# EAGLE design chart2 (EAGLE 7.6.0)
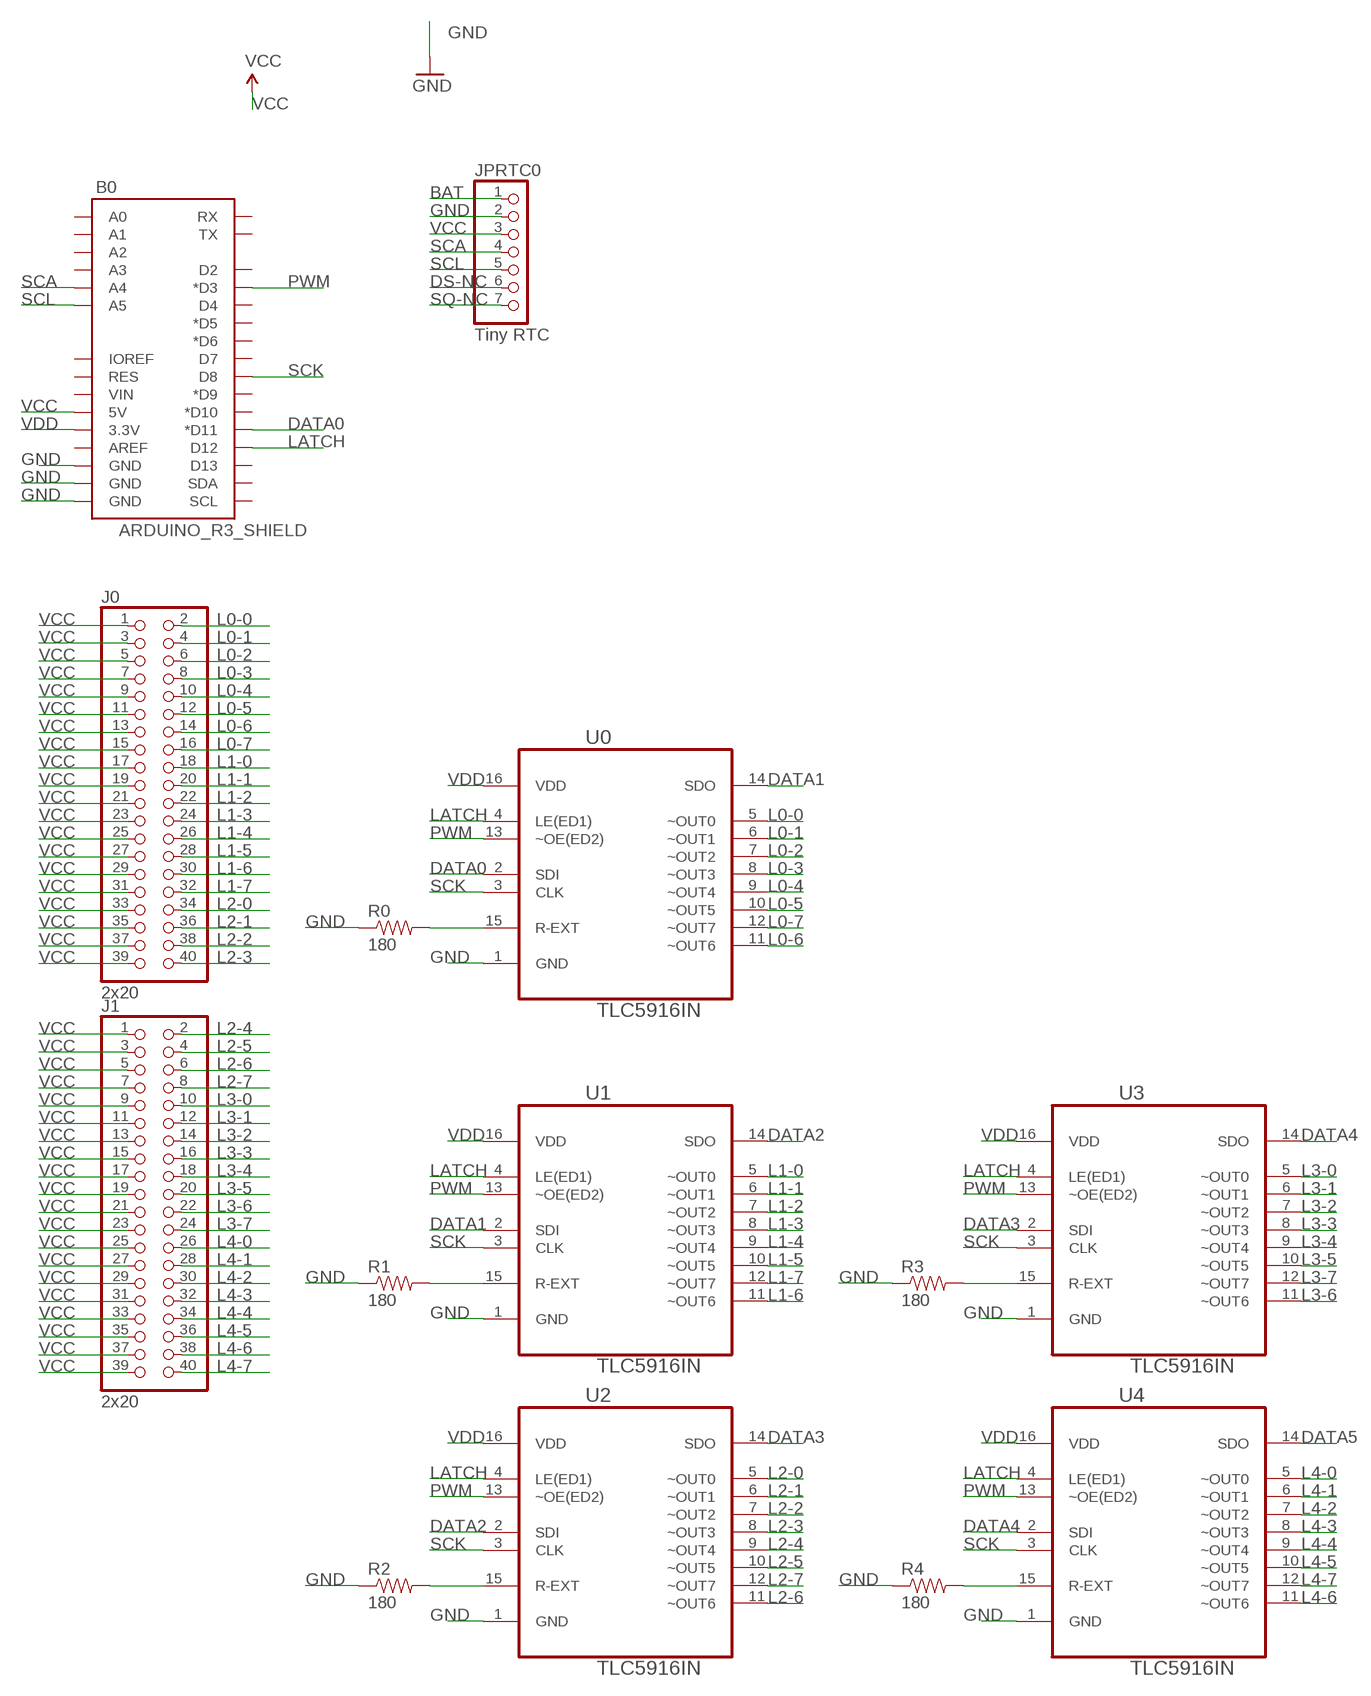
[diagram p0: schematic, sheet 1]

## Parts
B0  ARDUINO_R3_SHIELD  [UNO_R3_SHIELD]
J0  2x20  PINHD-2X20/90  [2X20/90]
J1  2x20  PINHD-2X20/90  [2X20/90]
JPRTC0  Tiny RTC  PINHD-1X7  [1X07]
R0  180  RESISTORPTH-1/4W  [AXIAL-0.4]
R1  180  RESISTORPTH-1/4W  [AXIAL-0.4]
R2  180  RESISTORPTH-1/4W  [AXIAL-0.4]
R3  180  RESISTORPTH-1/4W  [AXIAL-0.4]
R4  180  RESISTORPTH-1/4W  [AXIAL-0.4]
U0  TLC5916IN  [DIP254P762X508-16]
U1  TLC5916IN  [DIP254P762X508-16]
U2  TLC5916IN  [DIP254P762X508-16]
U3  TLC5916IN  [DIP254P762X508-16]
U4  TLC5916IN  [DIP254P762X508-16]

## Nets
BAT: JPRTC0.1
DATA0: B0.D11(*D11) U0.2(SDI)
DATA1: U0.14(SDO) U1.2(SDI)
DATA2: U1.14(SDO) U2.2(SDI)
DATA3: U2.14(SDO) U3.2(SDI)
DATA4: U3.14(SDO) U4.2(SDI)
DATA5: U4.14(SDO)
DS-NC: JPRTC0.6
GND [ground]: B0.GND@0(GND) B0.GND@1(GND) B0.GND@2(GND) JPRTC0.2 R0.P$1 R1.P$1 R2.P$1 R3.P$1 R4.P$1 U0.1(GND) U1.1(GND) U2.1(GND) U3.1(GND) U4.1(GND)
L0-0: J0.2 U0.5(~OUT0)
L0-1: J0.4 U0.6(~OUT1)
L0-2: J0.6 U0.7(~OUT2)
L0-3: J0.8 U0.8(~OUT3)
L0-4: J0.10 U0.9(~OUT4)
L0-5: J0.12 U0.10(~OUT5)
L0-6: J0.14 U0.11(~OUT6)
L0-7: J0.16 U0.12(~OUT7)
L1-0: J0.18 U1.5(~OUT0)
L1-1: J0.20 U1.6(~OUT1)
L1-2: J0.22 U1.7(~OUT2)
L1-3: J0.24 U1.8(~OUT3)
L1-4: J0.26 U1.9(~OUT4)
L1-5: J0.28 U1.10(~OUT5)
L1-6: J0.30 U1.11(~OUT6)
L1-7: J0.32 U1.12(~OUT7)
L2-0: J0.34 U2.5(~OUT0)
L2-1: J0.36 U2.6(~OUT1)
L2-2: J0.38 U2.7(~OUT2)
L2-3: J0.40 U2.8(~OUT3)
L2-4: J1.2 U2.9(~OUT4)
L2-5: J1.4 U2.10(~OUT5)
L2-6: J1.6 U2.11(~OUT6)
L2-7: J1.8 U2.12(~OUT7)
L3-0: J1.10 U3.5(~OUT0)
L3-1: J1.12 U3.6(~OUT1)
L3-2: J1.14 U3.7(~OUT2)
L3-3: J1.16 U3.8(~OUT3)
L3-4: J1.18 U3.9(~OUT4)
L3-5: J1.20 U3.10(~OUT5)
L3-6: J1.22 U3.11(~OUT6)
L3-7: J1.24 U3.12(~OUT7)
L4-0: J1.26 U4.5(~OUT0)
L4-1: J1.28 U4.6(~OUT1)
L4-2: J1.30 U4.7(~OUT2)
L4-3: J1.32 U4.8(~OUT3)
L4-4: J1.34 U4.9(~OUT4)
L4-5: J1.36 U4.10(~OUT5)
L4-6: J1.38 U4.11(~OUT6)
L4-7: J1.40 U4.12(~OUT7)
LATCH: B0.D12 U0.4(LE(ED1)) U1.4(LE(ED1)) U2.4(LE(ED1)) U3.4(LE(ED1)) U4.4(LE(ED1))
N$1: R1.P$2 U1.15(R-EXT)
N$2: R2.P$2 U2.15(R-EXT)
N$3: R3.P$2 U3.15(R-EXT)
N$4: R4.P$2 U4.15(R-EXT)
N$6: R0.P$2 U0.15(R-EXT)
PWM: B0.D3(*D3) U0.13(~OE(ED2)) U1.13(~OE(ED2)) U2.13(~OE(ED2)) U3.13(~OE(ED2)) U4.13(~OE(ED2))
SCA: B0.A4 JPRTC0.4
SCK: B0.D8 U0.3(CLK) U1.3(CLK) U2.3(CLK) U3.3(CLK) U4.3(CLK)
SCL: B0.A5 JPRTC0.5
SQ-NC: JPRTC0.7
VCC [VCC]: B0.5V J0.1 J0.3 J0.5 J0.7 J0.9 J0.11 J0.13 J0.15 J0.17 J0.19 J0.21 J0.23 J0.25 J0.27 J0.29 J0.31 J0.33 J0.35 J0.37 J0.39 J1.1 J1.3 J1.5 J1.7 J1.9 J1.11 J1.13 J1.15 J1.17 J1.19 J1.21 J1.23 J1.25 J1.27 J1.29 J1.31 J1.33 J1.35 J1.37 J1.39 JPRTC0.3
VDD [VCC]: B0.3.3V U0.16(VDD) U1.16(VDD) U2.16(VDD) U3.16(VDD) U4.16(VDD)
Unconnected: B0.A0 B0.A1 B0.A2 B0.A3 B0.AREF B0.D2 B0.D4 B0.D5(*D5) B0.D6(*D6) B0.D7 B0.D9(*D9) B0.D10(*D10) B0.D13 B0.IOREF B0.RES B0.RX B0.SCL B0.SDA B0.TX B0.VIN

## Library data of the parts
B0 = SparkFun-Boards:ARDUINO_R3_SHIELD: Shield form compatible with the Arduino Uno R3.
J0 J1 = pinhead:PINHD-2X20: PIN HEADER
JPRTC0 = pinhead:PINHD-1X7: PIN HEADER
R0 R1-R4 = SparkFun-Resistors:RESISTOR: Resistor Basic schematic elements and footprints for 0603, 1206, and PTH resistors.
U0 U1-U4 = Texas Instruments_By_element14_Batch_1:TLC5916IN: 8-CHANNEL CONSTANT-CURRENT LED SINK DRIVERS; MPN: TLC5916IN; OC_FARNELL: 1647814; OC_NEWARK: 60M1749; PACKAGE: PDIP-16; SUPPLIER: Texas Instruments

## Net classes
0 default: width 0.254 mm, clearance 0.205 mm
1 ground: width 0.635 mm, clearance 0.205 mm to class 0, clearance 0.254 mm
2 VCC: width 0.635 mm, clearance 0.205 mm to class 0, clearance 0.205 mm to class 1, clearance 0.254 mm

## Board
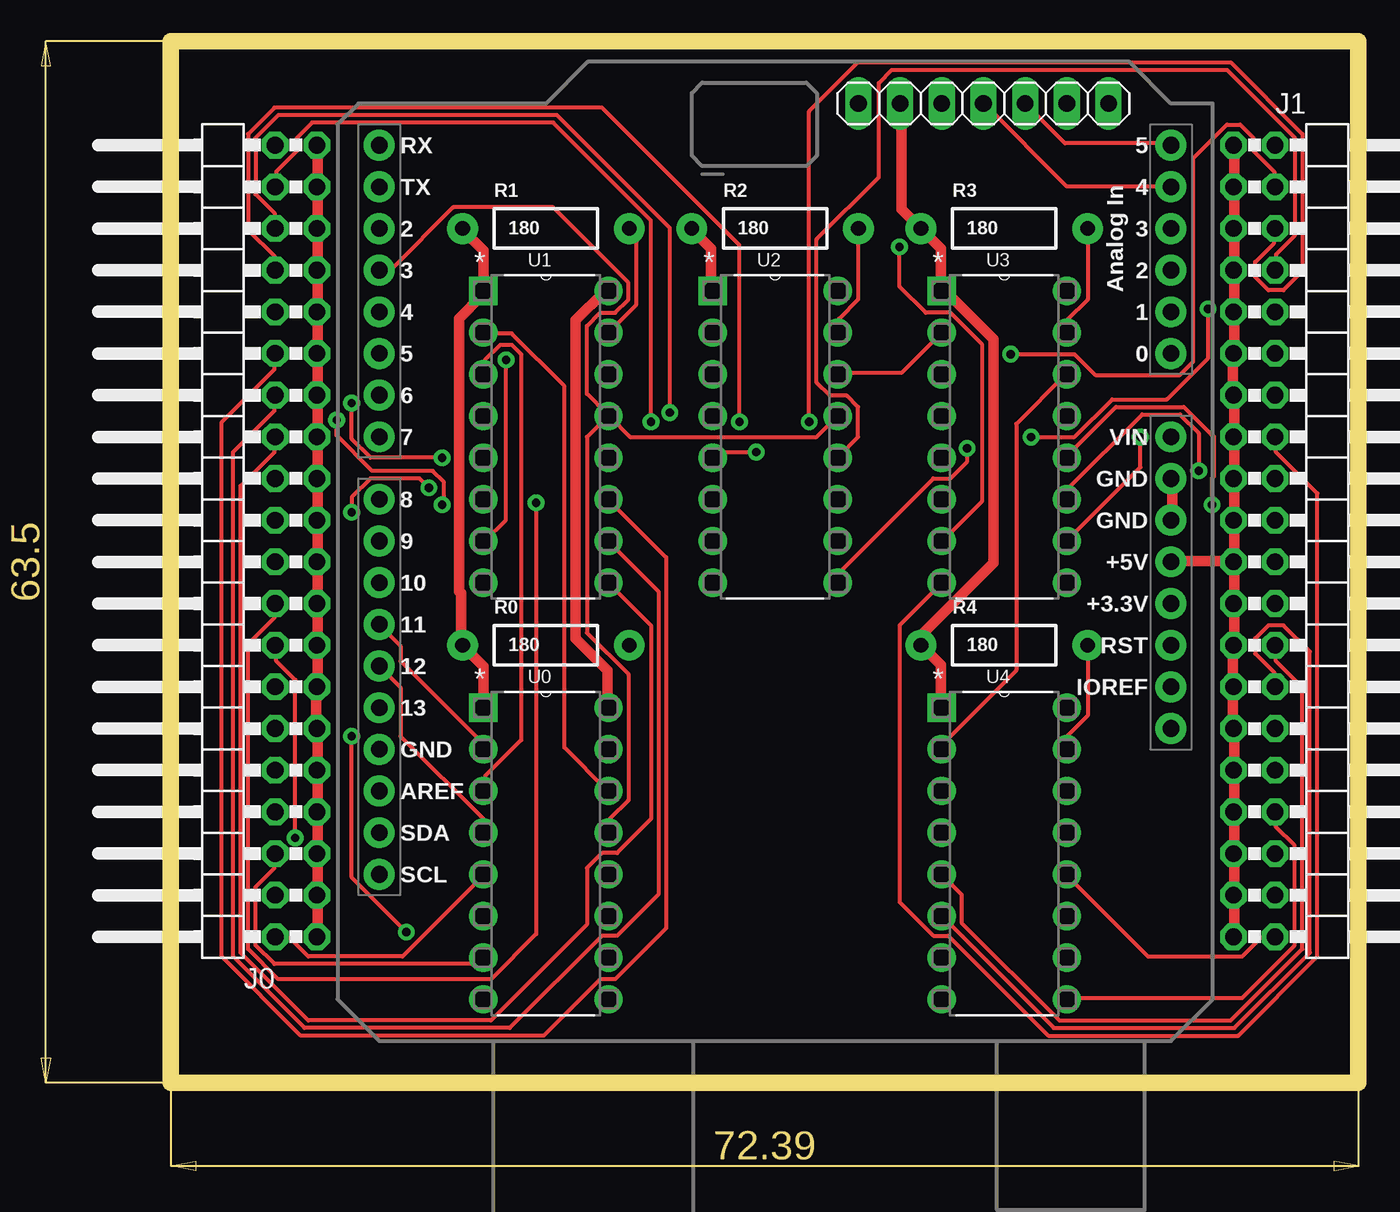
[diagram p1: board, top side]
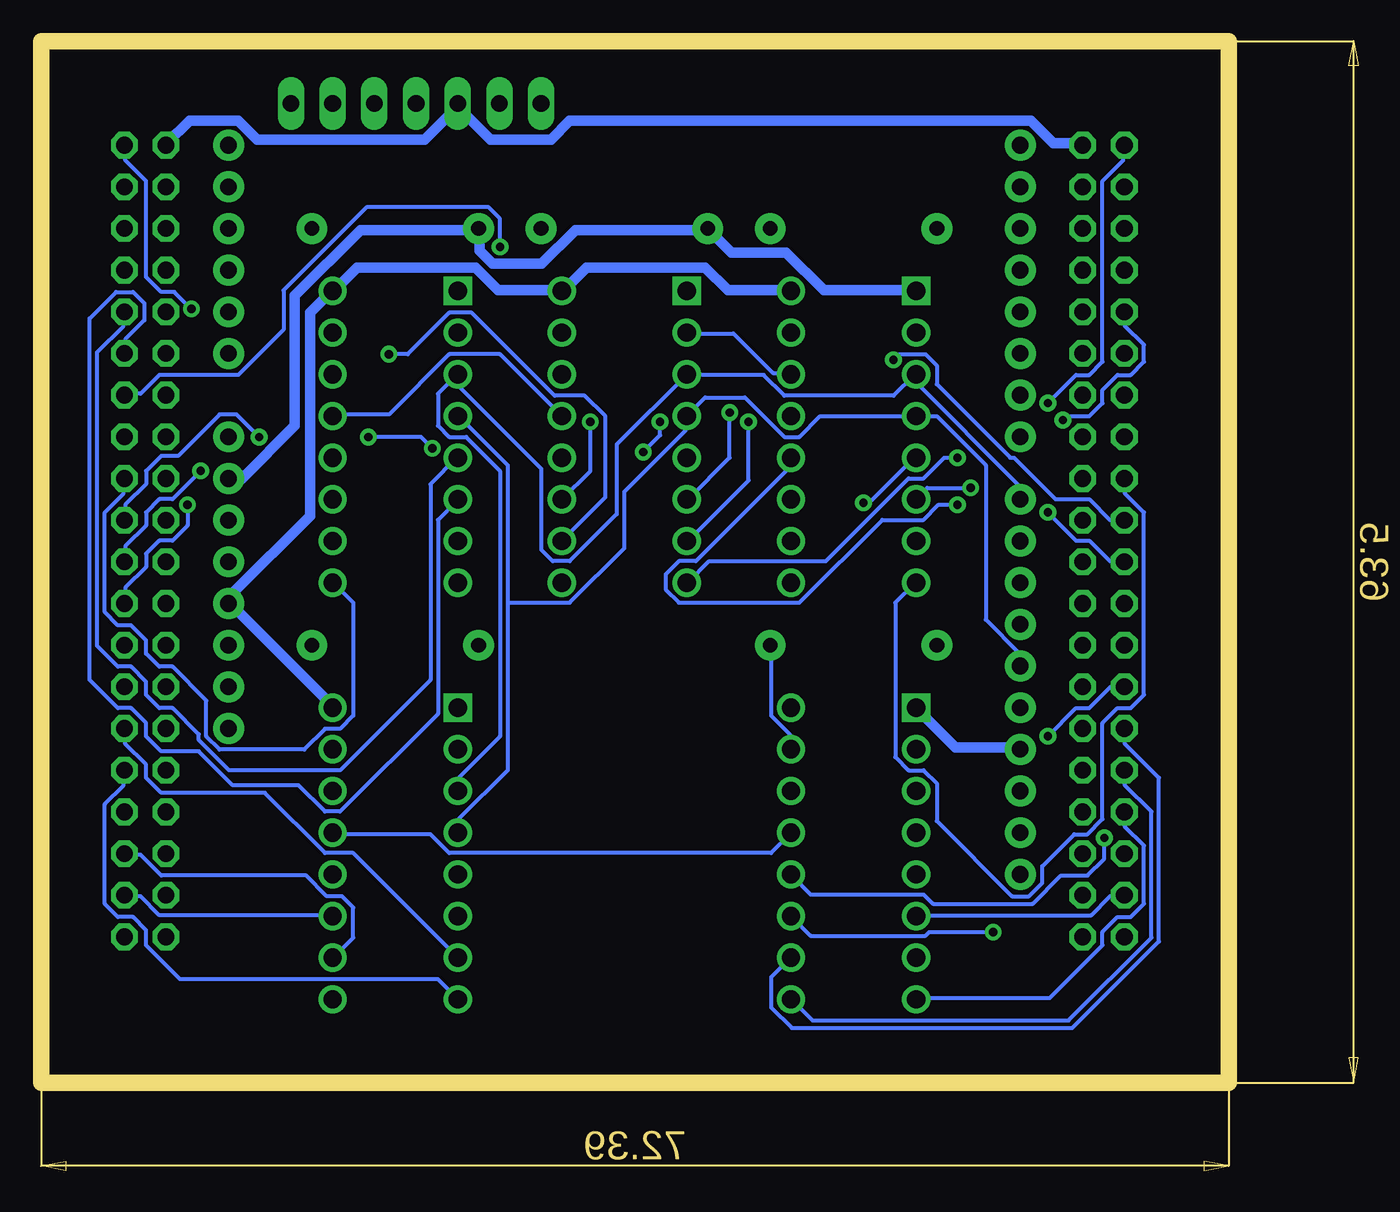
[diagram p2: board, bottom side, seen from below]

Size 72.39 x 63.5 mm. Coordinates in mm from the lower left corner, seen from the top.
Outline: 0,0 0,63.5 72.39,63.5 72.39,0 0,0
Copper layers (1*16): Top 0.035mm / dielectric 1.5mm / Bottom 0.035mm
Design rules "chart2": minimum track width 8mil, minimum drill 20mil, track to track 0.205mm, track to pad 0.205mm, pad to pad 0.205mm, via to via 0.205mm, smd to smd 8mil, copper to edge 10mil, drill to drill 8mil, minimum pad ring 12mil, minimum via ring 10mil, stop-mask expansion 4mil, vias tented up to drill 25mil, thermal gap 10mil

### Footprints (pad centres in the part's own frame; a part is rotated, then mirrored left to right if it is on the bottom)
UNO_R3_SHIELD = drill 1.016 pad 1.88: 3.3V 50.8,26.67; 5V 50.8,29.21; A0 50.8,41.91; A1 50.8,44.45; A2 50.8,46.99; A3 50.8,49.53; A4 50.8,52.07; A5 50.8,54.61; AREF 2.54,15.24; D2 2.54,49.53; D3 2.54,46.99; D4 2.54,44.45; D5 2.54,41.91; D6 2.54,39.37; D7 2.54,36.83; D8 2.54,33.02; D9 2.54,30.48; D10 2.54,27.94; D11 2.54,25.4; D12 2.54,22.86; D13 2.54,20.32; GND@0 50.8,31.75; GND@1 50.8,34.29; GND@2 2.54,17.78; IOREF 50.8,21.59; NC 50.8,19.05; RES 50.8,24.13; RX 2.54,54.61; SCL 2.54,10.16; SDA 2.54,12.7; TX 2.54,52.07; VIN 50.8,36.83
2X20/90 = drill 1.016 octagon: 1 -24.13,-6.35; 2 -24.13,-3.81; 3 -21.59,-6.35; 4 -21.59,-3.81; 5 -19.05,-6.35; 6 -19.05,-3.81; 7 -16.51,-6.35; 8 -16.51,-3.81; 9 -13.97,-6.35; 10 -13.97,-3.81; 11 -11.43,-6.35; 12 -11.43,-3.81; 13 -8.89,-6.35; 14 -8.89,-3.81; 15 -6.35,-6.35; 16 -6.35,-3.81; 17 -3.81,-6.35; 18 -3.81,-3.81; 19 -1.27,-6.35; 20 -1.27,-3.81; 21 1.27,-6.35; 22 1.27,-3.81; 23 3.81,-6.35; 24 3.81,-3.81; 25 6.35,-6.35; 26 6.35,-3.81; 27 8.89,-6.35; 28 8.89,-3.81; 29 11.43,-6.35; 30 11.43,-3.81; 31 13.97,-6.35; 32 13.97,-3.81; 33 16.51,-6.35; 34 16.51,-3.81; 35 19.05,-6.35; 36 19.05,-3.81; 37 21.59,-6.35; 38 21.59,-3.81; 39 24.13,-6.35; 40 24.13,-3.81
1X07 = drill 1.016 long: 1 -7.62,0; 2 -5.08,0; 3 -2.54,0; 4 0,0; 5 2.54,0; 6 5.08,0; 7 7.62,0
AXIAL-0.4 = drill 0.9 pad 1.88: P$1 -5.08,0; P$2 5.08,0
DIP254P762X508-16 = drill 1.118 square: 1 -7.62,17.78 | drill 1.118: 2 -7.62,15.24; 3 -7.62,12.7; 4 -7.62,10.16; 5 -7.62,7.62; 6 -7.62,5.08; 7 -7.62,2.54; 8 -7.62,0; 9 0,0; 10 0,2.54; 11 0,5.08; 12 0,7.62; 13 0,10.16; 14 0,12.7; 15 0,15.24; 16 0,17.78

### Placement (x,y rotation side)
B0  10.16,2.54 0 top
J0  2.54,33.02 90 top
J1  71.12,33.02 270 top
JPRTC0  49.53,59.69 0 top
R0  22.86,26.67 0 top
R1  22.86,52.07 0 top
R2  36.83,52.07 0 top
R3  50.8,52.07 0 top
R4  50.8,26.67 0 top
U0  26.67,5.08 0 top
U1  26.67,30.48 0 top
U2  40.64,30.48 0 top
U3  54.61,30.48 0 top
U4  54.61,5.08 0 top

### Tracks (layer width: path | path; a pad name or v marks a point on that pad's centre or on a via)
DATA0
  Top 0.254: U0.2 19.05,20.43 19.05,20.66 14,25.7 14,26.62 12.74,27.88 B0.D11
DATA1
  Top 0.254: U1.2 19.16,45.67 20.77,45.67 23.98,42.46 23.98,20.43 26.62,17.79 U0.14
DATA2
  Bottom 0.254: U1.14 26.74,43.26 27.77,43.26 30.18,45.67 32.93,45.67 U2.2
DATA3
  Top 0.254: U2.14 40.74,43.26 44.52,43.26 46.93,45.67 U3.2
DATA4
  Top 0.254: U4.2 47.05,20.43 47.05,20.66 51.52,25.13 51.52,40.16 54.51,43.15 U3.14
GND
  Top 0.635: U0.1 19.05,22.95 19.05,25.36 17.79,26.62 R0.P$1 17.67,26.97 17.67,29.84 17.56,29.95 17.56,46.59 18.93,47.97 U1.1 19.05,48.31 19.05,50.72 17.79,51.98 R1.P$1 | U2.1 32.93,48.31 32.93,50.83 31.79,51.98 R2.P$1 | U4.1 46.93,22.95 46.93,25.47 45.78,26.62 R4.P$1 45.78,26.97 45.78,27.31 50.15,31.67 50.15,45.33 47.28,48.2 U3.1 46.93,48.31 46.93,50.83 45.9,51.87 R3.P$1 45.67,52.1 44.52,53.24 44.52,59.67 JPRTC0.2 | B0.GND@0 61.05,34.31 61.05,36.72 B0.GND@1
  Bottom 0.635: B0.GND@2 12.74,20.43 16.64,20.43 19.05,22.84 U0.1 | U1.1 19.16,48.31 24.67,48.31 26.97,50.6 30.29,50.6 31.67,51.98 R2.P$1 32.02,51.98 39.82,51.98 41.88,49.92 44.87,49.92 45.67,50.72 45.67,51.75 R3.P$1 45.78,51.98 52.9,51.98 56.92,47.97 56.92,40.05 60.13,36.84 60.93,36.84 B0.GND@1
L0-0
  Top 0.254: J0.2 6.43,8.84 7.23,8.84 8.38,7.69 14.11,7.69 19.05,12.62 U0.5
L0-1
  Bottom 0.254: J0.4 6.43,11.36 7.23,11.36 8.38,10.21 19.05,10.21 U0.6
L0-2
  Top 0.254: J0.6 6.31,13.88 6.31,13.08 5.16,11.93 5.16,8.38 6.31,7.23 18.7,7.23 19.05,7.57 U0.7
L0-3
  Bottom 0.254: J0.8 6.31,16.41 6.31,15.61 5.16,14.46 5.16,10.9 5.97,10.1 6.77,10.1 7.69,9.18 7.69,8.38 10.9,5.16 19.05,5.16 U0.8
L0-4
  Bottom 0.254: J0.10 6.31,19.05 6.31,18.13 4.71,16.52 4.71,8.84 9.75,3.79 25.36,3.79 26.62,5.05 U0.9
L0-5
  Bottom 0.254: J0.12 6.31,21.57 6.31,20.66 4.25,18.59 4.25,8.61 9.52,3.33 26.62,3.33 27.88,4.59 27.88,6.43 26.74,7.57 U0.10
L0-6  (via drill 0.51)
  Top 0.254: v11.02,21.11 11.02,12.51 v14.34,9.18
  Bottom 0.254: v11.02,21.11 9.29,22.84 8.49,22.84 7.23,24.1 6.43,24.1 J0.14 | v14.34,9.18 18.25,9.18 18.48,8.95 25.47,8.95 26.62,10.1 U0.11
L0-7  (via drill 0.51)
  Top 0.254: v7.57,14.92 7.57,24.56 6.43,25.7 6.43,26.62 J0.16
  Bottom 0.254: v7.57,14.92 7.57,13.65 8.61,12.62 10.21,12.62 11.93,10.9 18.02,10.9 18.59,11.47 25.47,11.47 26.62,12.62 U0.12
L1-0  (via drill 0.51)
  Top 0.254: v22.26,35.34 22.26,9.06 19.51,6.31 6.54,6.31 4.71,8.15 4.71,26.74 6.31,28.34 6.31,29.15 J0.18
  Bottom 0.254: v22.26,35.34 21.92,35.34 19.16,38.1 U1.5
L1-1  (via drill 0.51)
  Top 0.254: v11.02,34.77 11.02,35.69 12.16,36.84 15.15,36.84 v15.72,36.26
  Bottom 0.254: v11.02,34.77 9.29,33.05 8.49,33.05 7.23,31.79 6.43,31.79 J0.20 | v15.72,36.26 18.36,36.26 19.05,35.57 U1.6
L1-2  (via drill 0.51)
  Top 0.254: v20.43,44.06 20.43,34.31 19.16,33.05 U1.7
  Bottom 0.254: v20.43,44.06 20.08,44.41 18.48,44.41 17.79,43.72 17.79,42.57 13.31,38.1 13.08,38.1 10.56,35.57 8.49,35.57 7.23,34.31 6.43,34.31 J0.22
L1-3
  Bottom 0.254: J0.24 6.31,36.72 6.31,35.92 5.16,34.77 5.16,23.64 5.97,22.84 6.77,22.84 7.69,21.92 7.69,16.07 8.61,15.15 9.41,15.15 11.36,13.2 11.36,12.16 12.16,11.36 13.2,11.36 17.79,15.95 17.79,18.25 18.59,19.05 19.51,19.05 20.31,19.85 20.31,29.26 19.16,30.41 U1.8
L1-4
  Top 0.254: J0.26 6.31,39.36 6.31,38.44 4.25,36.38 4.25,7.92 8.38,3.79 19.51,3.79 25.36,9.64 25.36,13.08 26.28,14 27.2,14 29.26,16.07 29.26,27.88 26.74,30.41 U1.9
L1-5
  Top 0.254: J0.28 6.31,41.88 6.31,40.97 3.79,38.44 3.79,7.69 8.15,3.33 20.66,3.33 26.28,8.95 27.2,8.95 29.72,11.47 29.72,29.95 26.74,32.93 U1.10
L1-6
  Top 0.254: J0.30 6.31,44.41 6.31,43.49 3.1,40.28 3.1,7.69 7.92,2.87 22.72,2.87 26.16,6.31 27.08,6.31 30.18,9.41 30.18,32.02 26.74,35.46 U1.11
L1-7  (via drill 0.51)
  Top 0.254: v10.1,40.39 10.1,39.47 12.28,37.29 15.95,37.29 16.64,36.6 16.64,35.34 v16.52,35.23
  Bottom 0.254: v10.1,40.39 9.87,40.62 8.49,40.62 7.69,41.42 7.69,42.23 6.77,43.15 5.97,43.15 5.16,43.95 5.16,44.98 6.31,46.13 6.31,46.93 J0.32 | v16.52,35.23 17.67,35.23 18.59,34.31 21.11,34.31 26.16,29.26 33.51,29.26 34.31,30.06 34.31,30.98 33.51,31.79 32.47,31.79 26.74,37.52 26.74,38.1 U1.12
L2-0  (via drill 0.51)
  Top 0.254: v34.65,40.28 34.65,51.06 26.28,59.44 6.31,59.44 4.71,57.83 4.71,51.98 6.31,50.38 6.31,49.57 J0.34 | v35.69,38.44 33.28,38.44 33.05,38.21 U2.5
  Bottom 0.254: v34.65,40.28 34.65,39.47 v35.69,38.44
L2-1  (via drill 0.51)
  Top 0.254: v30.41,40.85 30.41,52.1 23.52,58.98 6.54,58.98 5.16,57.6 5.16,54.16 6.31,53.01 6.31,52.1 J0.36
  Bottom 0.254: v30.41,40.85 30.41,38.1 32.93,35.57 U2.6
L2-2  (via drill 0.51)
  Top 0.254: v29.26,40.28 29.26,52.56 23.29,58.52 8.61,58.52 7.69,57.6 7.69,56.8 6.43,55.54 6.43,54.62 J0.38
  Bottom 0.254: v29.26,40.28 29.26,36.72 32.93,33.05 U2.7
L2-3  (via drill 0.51)
  Top 0.254: v11.02,41.42 11.02,39.24 12.16,38.1 v16.52,38.1
  Bottom 0.254: v11.02,41.42 9.29,43.15 8.49,43.15 7.69,43.95 7.69,54.97 6.43,56.23 6.43,57.15 J0.40 | v16.52,38.1 17.33,38.1 18.59,36.84 19.51,36.84 24.56,31.79 31.67,31.79 32.93,30.52 U2.8
L2-4  (via drill 0.51)
  Top 0.254: v63.23,47.16 63.23,44.18 60.7,41.65 57.38,41.65 55.08,39.36 v52.44,39.36 | v48.54,38.67 48.54,37.87 47.51,36.84 46.47,36.84 40.74,31.1 40.74,30.52 U2.9
  Bottom 0.254: v63.23,47.16 64.26,48.2 65.06,48.2 65.98,49.11 65.98,54.97 67.24,56.23 67.24,57.15 J1.2 | v52.44,39.36 49.23,39.36 v48.54,38.67
L2-5  (via drill 0.51)
  Top 0.254: v51.18,44.41 55.08,44.41 56.34,43.15 61.51,43.15 62.31,43.95 62.31,56.34 64.38,58.41 65.18,58.41 65.98,57.6 65.98,56.8 67.24,55.54 67.24,54.62 J1.4
  Bottom 0.254: v51.18,44.41 50.03,44.41 47.51,46.93 46.13,46.93 41.08,41.88 39.24,41.88 37.98,40.62 37.98,35.69 40.62,33.05 U2.10
L2-6  (via drill 0.51)
  Top 0.254: v38.9,40.28 38.9,59.21 41.88,62.19 64.6,62.19 68.97,57.83 68.97,49.46 67.82,48.31 66.9,48.31 66.1,49.11 66.1,50.03 67.24,51.18 67.24,51.98 J1.6
  Bottom 0.254: v38.9,40.28 38.9,37.29 40.62,35.57 U2.11
L2-7
  Top 0.254: J1.8 67.36,49.57 67.36,50.49 68.51,51.64 68.51,57.6 64.38,61.74 43.95,61.74 43.15,60.93 43.15,55.2 39.36,51.41 39.36,42.69 40.16,41.88 41.2,41.88 41.88,41.2 41.88,39.36 40.74,38.21 U2.12
L3-0
  Bottom 0.254: J1.10 67.36,46.93 67.36,46.13 68.97,44.52 68.97,26.62 67.7,25.36 66.9,25.36 65.98,24.44 65.98,23.64 65.18,22.84 64.38,22.84 62.77,21.23 62.77,20.88 60.93,19.05 54.16,19.05 48.65,24.56 48.65,36.49 47.05,38.1 U3.5
L3-1
  Bottom 0.254: J1.12 67.24,44.52 67.24,45.33 66.1,46.47 66.1,47.51 66.78,48.2 67.82,48.2 69.42,46.59 69.42,24.56 67.7,22.84 66.9,22.84 65.98,21.92 65.98,21.11 65.06,20.2 62.77,20.2 60.7,18.13 56.69,18.13 55.08,16.52 54.16,16.52 48.2,22.49 48.2,34.31 47.05,35.46 U3.6
L3-2  (via drill 0.51)
  Top 0.254: v44.41,50.95 44.41,48.54 46.02,46.93 47.51,46.93 49.46,44.98 49.46,35.46 47.05,33.05 U3.7
  Bottom 0.254: v44.41,50.95 44.41,52.67 45.1,53.36 52.56,53.36 57.6,48.31 57.6,45.9 60.36,43.15 65.18,43.15 66.33,42 67.24,42 J1.14
L3-3
  Top 0.254: J1.16 67.36,39.36 67.36,38.44 69.88,35.92 69.88,7.69 65.06,2.87 53.47,2.87 47.39,8.95 46.47,8.95 44.41,11.02 44.41,27.88 46.93,30.41 U3.8
L3-4
  Bottom 0.254: J1.18 67.36,36.72 67.36,35.92 68.51,34.77 68.51,28.69 67.7,27.88 66.9,27.88 65.98,26.97 65.98,26.16 65.18,25.36 64.38,25.36 62.31,23.29 62.31,21.11 61.51,20.31 56.34,20.31 55.08,21.57 54.16,21.57 53.36,22.38 53.36,29.26 54.51,30.41 U3.9
L3-5  (via drill 0.51)
  Top 0.254: v59.1,39.36 59.1,37.52 54.62,33.05 U3.10
  Bottom 0.254: v59.1,39.36 60.47,40.74 61.51,40.74 64.03,38.21 65.06,38.21 65.98,37.29 65.98,36.49 67.24,35.23 67.24,34.31 J1.20
L3-6  (via drill 0.51)
  Top 0.254: v62.65,37.29 62.65,39.59 61.51,40.74 59.21,40.74 54.62,36.15 54.62,35.57 U3.11
  Bottom 0.254: v62.65,37.29 64.38,35.57 65.18,35.57 65.98,34.77 65.98,33.97 67.24,32.7 67.24,31.79 J1.22
L3-7  (via drill 0.51)
  Top 0.254: v63.46,35.23 63.46,36.84 63.57,36.95 63.57,39.36 61.74,41.2 57.6,41.2 54.62,38.21 U3.12
  Bottom 0.254: v63.46,35.23 63.46,33.97 64.38,33.05 65.18,33.05 65.98,32.24 65.98,31.44 67.24,30.18 67.24,29.26 J1.24
L4-0
  Top 0.254: J1.26 67.36,26.62 67.36,25.7 68.97,24.1 68.97,8.15 64.6,3.79 54.16,3.79 48.2,9.75 48.2,11.47 47.05,12.62 U4.5
L4-1
  Top 0.254: J1.28 67.24,24.21 67.24,25.02 66.1,26.16 66.1,27.08 66.9,27.88 67.82,27.88 69.42,26.28 69.42,7.92 64.83,3.33 53.82,3.33 47.05,10.1 U4.6
L4-2
  Bottom 0.254: J1.30 67.24,21.57 67.24,20.66 65.98,19.39 65.98,18.59 65.06,17.67 58.75,17.67 55.08,14 53.36,14 47.05,7.69 U4.7
L4-3
  Bottom 0.254: J1.32 67.36,19.05 67.36,18.13 68.51,16.98 68.51,10.9 67.7,10.1 66.78,10.1 65.98,9.29 65.98,8.38 63.92,6.31 48.2,6.31 47.05,5.16 U4.8
L4-4
  Top 0.254: J1.34 67.36,16.41 67.36,15.61 68.51,14.46 68.51,8.38 65.29,5.16 54.62,5.16 U4.9
L4-5
  Bottom 0.254: J1.36 67.24,13.88 66.33,13.88 65.06,12.62 56.23,12.62 54.97,11.36 54.05,11.36 53.36,10.67 53.36,8.84 54.51,7.69 U4.10
L4-6
  Bottom 0.254: J1.38 67.24,11.36 66.33,11.36 65.18,10.21 54.62,10.21 U4.11
L4-7
  Top 0.254: J1.40 67.24,8.84 66.44,8.84 65.29,7.69 59.55,7.69 54.62,12.62 U4.12
LATCH
  Top 0.254: U0.4 19.05,15.26 19.05,16.07 14,21.11 14,24.1 12.74,25.36 B0.D12
  Bottom 0.254: 43.95,29.26 43.95,37.64 46.93,40.62 U3.4 | 43.95,29.26 43.95,19.05 46.93,16.07 46.93,15.26 U4.4 | 43.95,29.26 40.16,29.26 36.84,32.59 36.84,36.03 33.05,39.82 33.05,40.62 U2.4 32.93,40.74 31.9,41.77 29.49,41.77 27.08,39.36 26.16,39.36 24.9,40.62 19.16,40.62 U1.4 18.93,40.62 17.79,40.62 14.8,37.64 14.8,28.23 12.74,26.16 12.74,25.47 B0.D12
N$1
  Top 0.254: U1.15 26.74,45.78 28.34,47.39 28.34,51.64 28,51.98 R1.P$2
N$2
  Top 0.254: U2.15 40.74,45.78 40.74,46.59 41.88,47.74 41.88,51.98 R2.P$2
N$3
  Top 0.254: U3.15 54.62,45.78 54.62,46.47 55.88,47.74 55.88,51.98 R3.P$2
N$4
  Top 0.254: U4.15 54.62,20.43 54.62,21.11 55.88,22.38 55.88,26.62 R4.P$2
N$6
  Bottom 0.254: U0.15 26.74,20.43 26.74,21.23 27.88,22.38 27.88,26.62 R0.P$2
PWM
  Top 0.254: U0.13 26.74,15.26 26.74,16.07 27.88,17.21 27.88,24.9 25.36,27.43 25.36,39.36 26.62,40.62 U1.13 | U2.13 39.36,39.36 28,39.36 26.74,40.62 U1.13 | B0.D3 12.74,49.57 13.43,49.57 17.21,53.36 23.29,53.36 27.88,48.77 27.88,47.74 27.08,46.93 26.16,46.93 25.36,46.13 25.36,42 26.62,40.74 U1.13
  Bottom 0.254: U4.13 54.51,15.15 48.65,15.15 47.51,14 27.88,14 26.74,15.15 U0.13 | U2.13 44.41,44.41 47.51,44.41 51.18,40.74 54.51,40.74 U3.13
SCA
  Top 0.254: JPRTC0.4 49.57,59.67 54.62,54.62 60.93,54.62 B0.A4
SCK
  Top 0.254: U0.3 19.16,17.79 19.16,18.7 21.34,20.88 21.34,44.41 20.77,44.98 20.08,44.98 19.16,44.06 19.16,43.26 U1.3
  Bottom 0.254: U4.3 46.93,17.79 46.93,18.59 44.41,21.11 44.41,37.29 46.47,39.36 47.51,39.36 48.2,40.05 48.2,42 47.05,43.15 U3.3 47.28,42.8 41.88,37.41 41.88,32.47 41.2,31.79 40.16,31.79 37.29,34.65 37.29,38.9 33.05,43.15 U2.3 32.93,43.15 28.34,43.15 27.08,41.88 20.43,41.88 19.16,43.15 U1.3 19.28,42.92 12.74,36.38 12.74,35.57 B0.D8
SCL
  Top 0.254: JPRTC0.5 52.1,59.67 54.51,57.26 60.93,57.26 B0.A5
VCC
  Top 0.635: J0.1 8.95,8.95 8.95,11.36 J0.3 8.95,11.7 8.95,13.88 J0.5 8.95,14.23 8.95,16.41 J0.7 8.95,16.75 8.95,19.05 J0.9 8.95,19.28 8.95,21.57 J0.11 8.84,21.92 8.84,24.1 J0.13 8.95,24.44 8.95,26.62 J0.15 8.95,26.97 8.95,29.15 J0.17 8.95,29.49 8.95,31.67 J0.19 8.95,32.02 8.95,34.2 J0.21 8.95,34.54 8.95,36.72 J0.23 8.95,37.06 8.95,39.36 J0.25 8.95,39.59 8.95,41.88 J0.27 8.95,42.23 8.95,44.41 J0.29 8.95,44.75 8.95,46.93 J0.31 8.95,47.28 8.95,49.46 J0.33 8.95,49.8 8.95,51.98 J0.35 8.95,52.33 8.95,54.51 J0.37 8.95,54.85 8.95,57.15 J0.39 | J1.39 64.83,8.95 64.83,11.36 J1.37 64.83,11.7 64.83,13.88 J1.35 64.83,14.23 64.83,16.41 J1.33 64.83,16.75 64.83,19.05 J1.31 64.83,19.28 64.83,21.57 J1.29 64.72,21.92 64.72,24.1 J1.27 64.72,24.44 64.72,26.62 J1.25 64.83,26.97 64.83,29.15 J1.23 64.83,29.49 64.83,31.67 J1.21 | J1.21 64.83,32.02 64.83,34.2 J1.19 64.83,34.54 64.83,36.72 J1.17 64.83,37.06 64.83,39.36 J1.15 64.83,39.59 64.83,41.88 J1.13 64.72,42.23 64.72,44.41 J1.11 64.83,44.75 64.83,46.93 J1.9 64.83,47.28 64.83,49.46 J1.7 64.83,49.8 64.83,51.98 J1.5 64.83,52.33 64.83,54.51 J1.3 64.83,54.85 64.83,57.15 J1.1 | B0.5V 61.05,31.79 64.49,31.79 J1.21
  Bottom 0.635: J1.1 64.72,57.26 63.34,58.64 60.36,58.64 59.21,57.49 49,57.49 47.05,59.44 47.05,59.67 JPRTC0.3 46.82,59.33 44.98,57.49 41.31,57.49 40.16,58.64 12.05,58.64 10.67,57.26 8.95,57.26 J0.39
VDD
  Top 0.635: U0.16 26.62,22.95 26.62,25.13 24.67,27.08 24.67,46.47 26.39,48.2 26.62,48.2 U1.16
  Bottom 0.635: U4.16 54.62,22.95 60.93,29.26 B0.3.3V 60.7,29.49 60.7,29.84 56,34.54 56,46.93 54.85,48.08 U3.16 54.51,48.31 53.13,49.69 45.9,49.69 44.52,48.31 40.74,48.31 U2.16 40.39,48.42 39.13,49.69 31.9,49.69 30.52,48.31 26.74,48.31 U1.16

### Text on the board
tDocu: Batt | Gnd | VCC | Batt
_tNames: JPRTC0 | J1 | R1 | R2 | R3 | U1 | U2 | U3 | R0 | R4 | U0 | U4 | J0
200bmp: C:/Users/jonross/Documents/Arduino/ChartLights/Eagle/Silkscreen/silk.bmp